# EAGLE schematic Microcontroller (EAGLE 9.5.2)
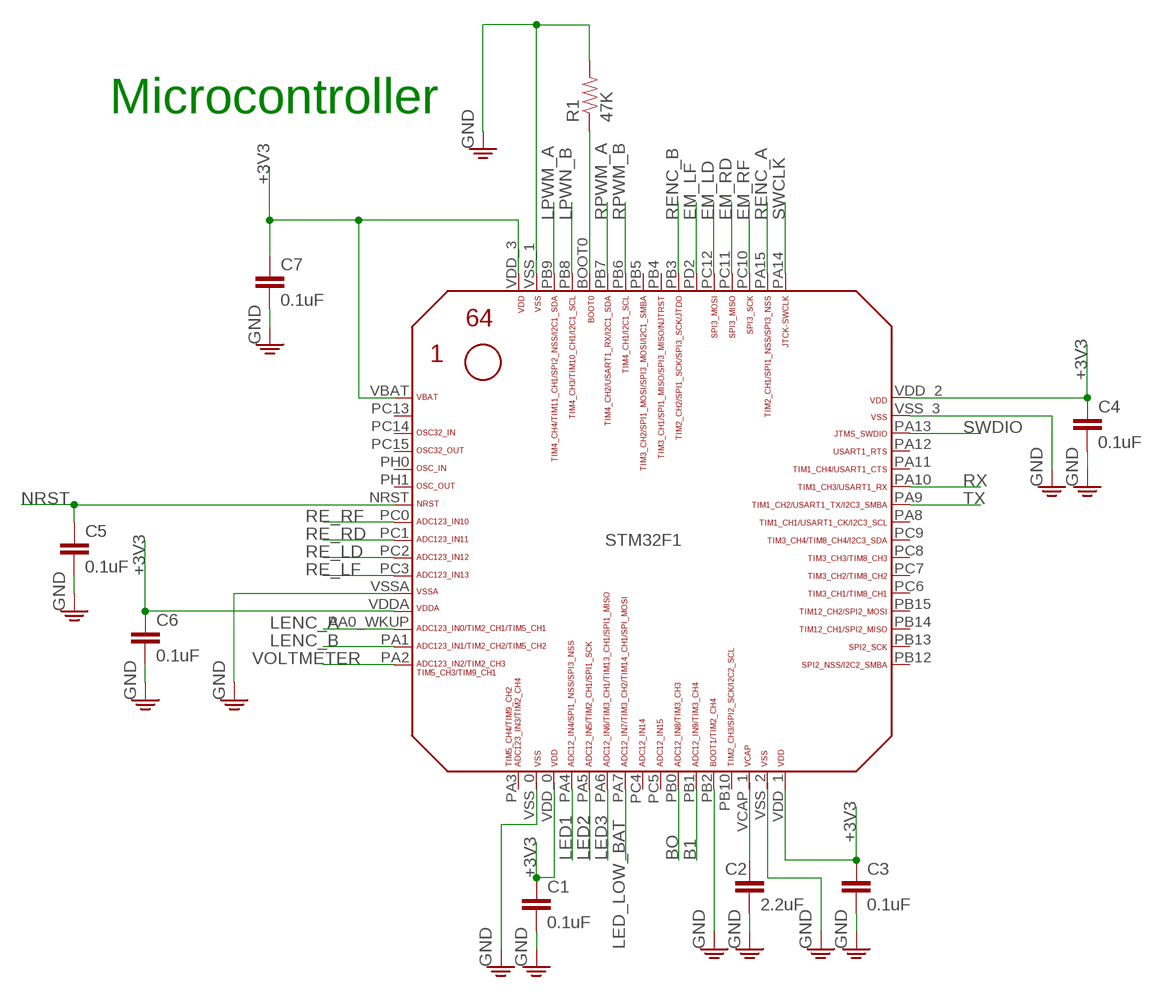
[diagram p0: schematic, sheet 1]

## Parts
C1  0.1uF  CAP_CERAMIC_0805IN_2012MM  [0805]
C2  2.2uF  CAP_CERAMIC_0805IN_2012MM  [0805]
C3  0.1uF  CAP_CERAMIC_0805IN_2012MM  [0805]
C4  0.1uF  CAP_CERAMIC_0805IN_2012MM  [0805]
C5  0.1uF  CAP_CERAMIC_0805IN_2012MM  [0805]
C6  0.1uF  CAP_CERAMIC_0805IN_2012MM  [0805]
C7  0.1uF  CAP_CERAMIC_0805IN_2012MM  [0805]
R1  47K  RESISTOR_0805IN_2012MM  [0805]
STM32F1  STM32F4_401_410_411_412_413_446  [LQFP64]

## Nets
+3V3: C1.1 C3.1 C4.1 C6.1 C7.1 STM32F1.VBAT STM32F1.VDD_0 STM32F1.VDD_1 STM32F1.VDD_2 STM32F1.VDD_3 STM32F1.VDDA
B1: STM32F1.PB1
BO: STM32F1.PB0
EM_LD: STM32F1.PC12
EM_LF: STM32F1.PD2
EM_RD: STM32F1.PC11
EM_RF: STM32F1.PC10
GND: C1.2 C2.2 C3.2 C4.2 C5.2 C6.2 C7.2 R1.2 STM32F1.PB2 STM32F1.VSS_0 STM32F1.VSS_1 STM32F1.VSS_2(VCAP_1) STM32F1.VSS_3(VCAP_2) STM32F1.VSSA
LED1: STM32F1.PA4
LED2: STM32F1.PA5
LED3: STM32F1.PA6
LED_LOW_BAT: STM32F1.PA7
LENC_A: STM32F1.PA0_WKUP(PA0_AKUP)
LENC_B: STM32F1.PA1
LPWM_A: STM32F1.PB9
LPWN_B: STM32F1.PB8
N$1: C2.1 STM32F1.VCAP_1(PB11)
N$3: R1.1 STM32F1.BOOT0
NRST: C5.1 STM32F1.NRST
RE_LD: STM32F1.PC2
RE_LF: STM32F1.PC3
RE_RD: STM32F1.PC1
RE_RF: STM32F1.PC0
RENC_A: STM32F1.PA15
RENC_B: STM32F1.PB3
RPWM_A: STM32F1.PB7
RPWM_B: STM32F1.PB6
RX: STM32F1.PA10
SWCLK: STM32F1.PA14
SWDIO: STM32F1.PA13
TX: STM32F1.PA9
VOLTMETER: STM32F1.PA2
Unconnected: STM32F1.PA3 STM32F1.PA8 STM32F1.PA11 STM32F1.PA12 STM32F1.PB4 STM32F1.PB5 STM32F1.PB10 STM32F1.PB12 STM32F1.PB13 STM32F1.PB14 STM32F1.PB15 STM32F1.PC4 STM32F1.PC5 STM32F1.PC6 STM32F1.PC7 STM32F1.PC8 STM32F1.PC9 STM32F1.PC13 STM32F1.PC14 STM32F1.PC15 STM32F1.PH0 STM32F1.PH1

## Notes on the sheet
- Microcontroller

## Library data of the parts
C1-C7 = CAP_CERAMIC_0805IN_2012MM:CAP_CERAMIC_0805IN_2012MM
R1 = RESISTOR_0805IN_2012MM:RESISTOR_0805IN_2012MM
STM32F1 = STM32F4_401_410_411_412_413_446:STM32F4_401_410_411_412_413_446